# Altium project FEU31_Part2.PrjPcb
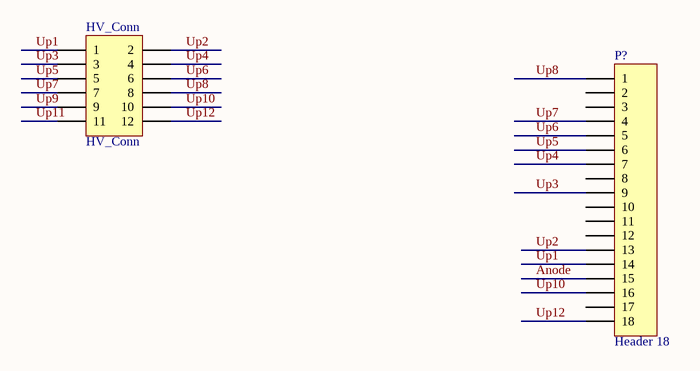
[diagram p0: FEU31_Part2.SchDoc]
1 sheet, 2 parts. Net scope: global (net labels, ports and power ports of the same name join across sheets).
Board file: 2_Lay_PCB.PcbDoc

## Sheet FEU31_Part2.SchDoc: Скальпель
size A3; Address1: (с) Быканов Андрей; Address2: г.Тула 2016г.; Revision: 1.3

### Parts
HV_Conn  HV_Conn  [HDR2X6H]
P?  Header 18  [R6231-01]

### Nets
Anode: P?.15
Up1: HV_Conn.1 P?.14
Up2: HV_Conn.2 P?.13
Up3: HV_Conn.3 P?.9
Up4: HV_Conn.4 P?.7
Up5: HV_Conn.5 P?.6
Up6: HV_Conn.6 P?.5
Up7: HV_Conn.7 P?.4
Up8: HV_Conn.8 P?.1
Up9: HV_Conn.9
Up10: HV_Conn.10 P?.16
Up11: HV_Conn.11
Up12: HV_Conn.12 P?.18

Not connected (* = marked no-connect by the designer): P? 2 3 8 10 11 12 17

### Notes on the sheet
- Title
- Size:
- Date:
- A3
- Number:
- Time:
- Revision:
- Sheet
- of
- File:

### Library data of the parts
HV_Conn = Header 6X2H: Header, 6-Pin, Dual row, Right Angle; LatestRevisionDate: 17-Jul-2002; LatestRevisionNote: Re-released for DXP Platform.; Publisher: Altium Limited
P? = Header 18: Header, 18-Pin; LatestRevisionDate: 17-Jul-2002; LatestRevisionNote: Re-released for DXP Platform.; Publisher: Altium Limited